# EAGLE design Raspberry_Pi_Lora_Shield (EAGLE 9.1.3)
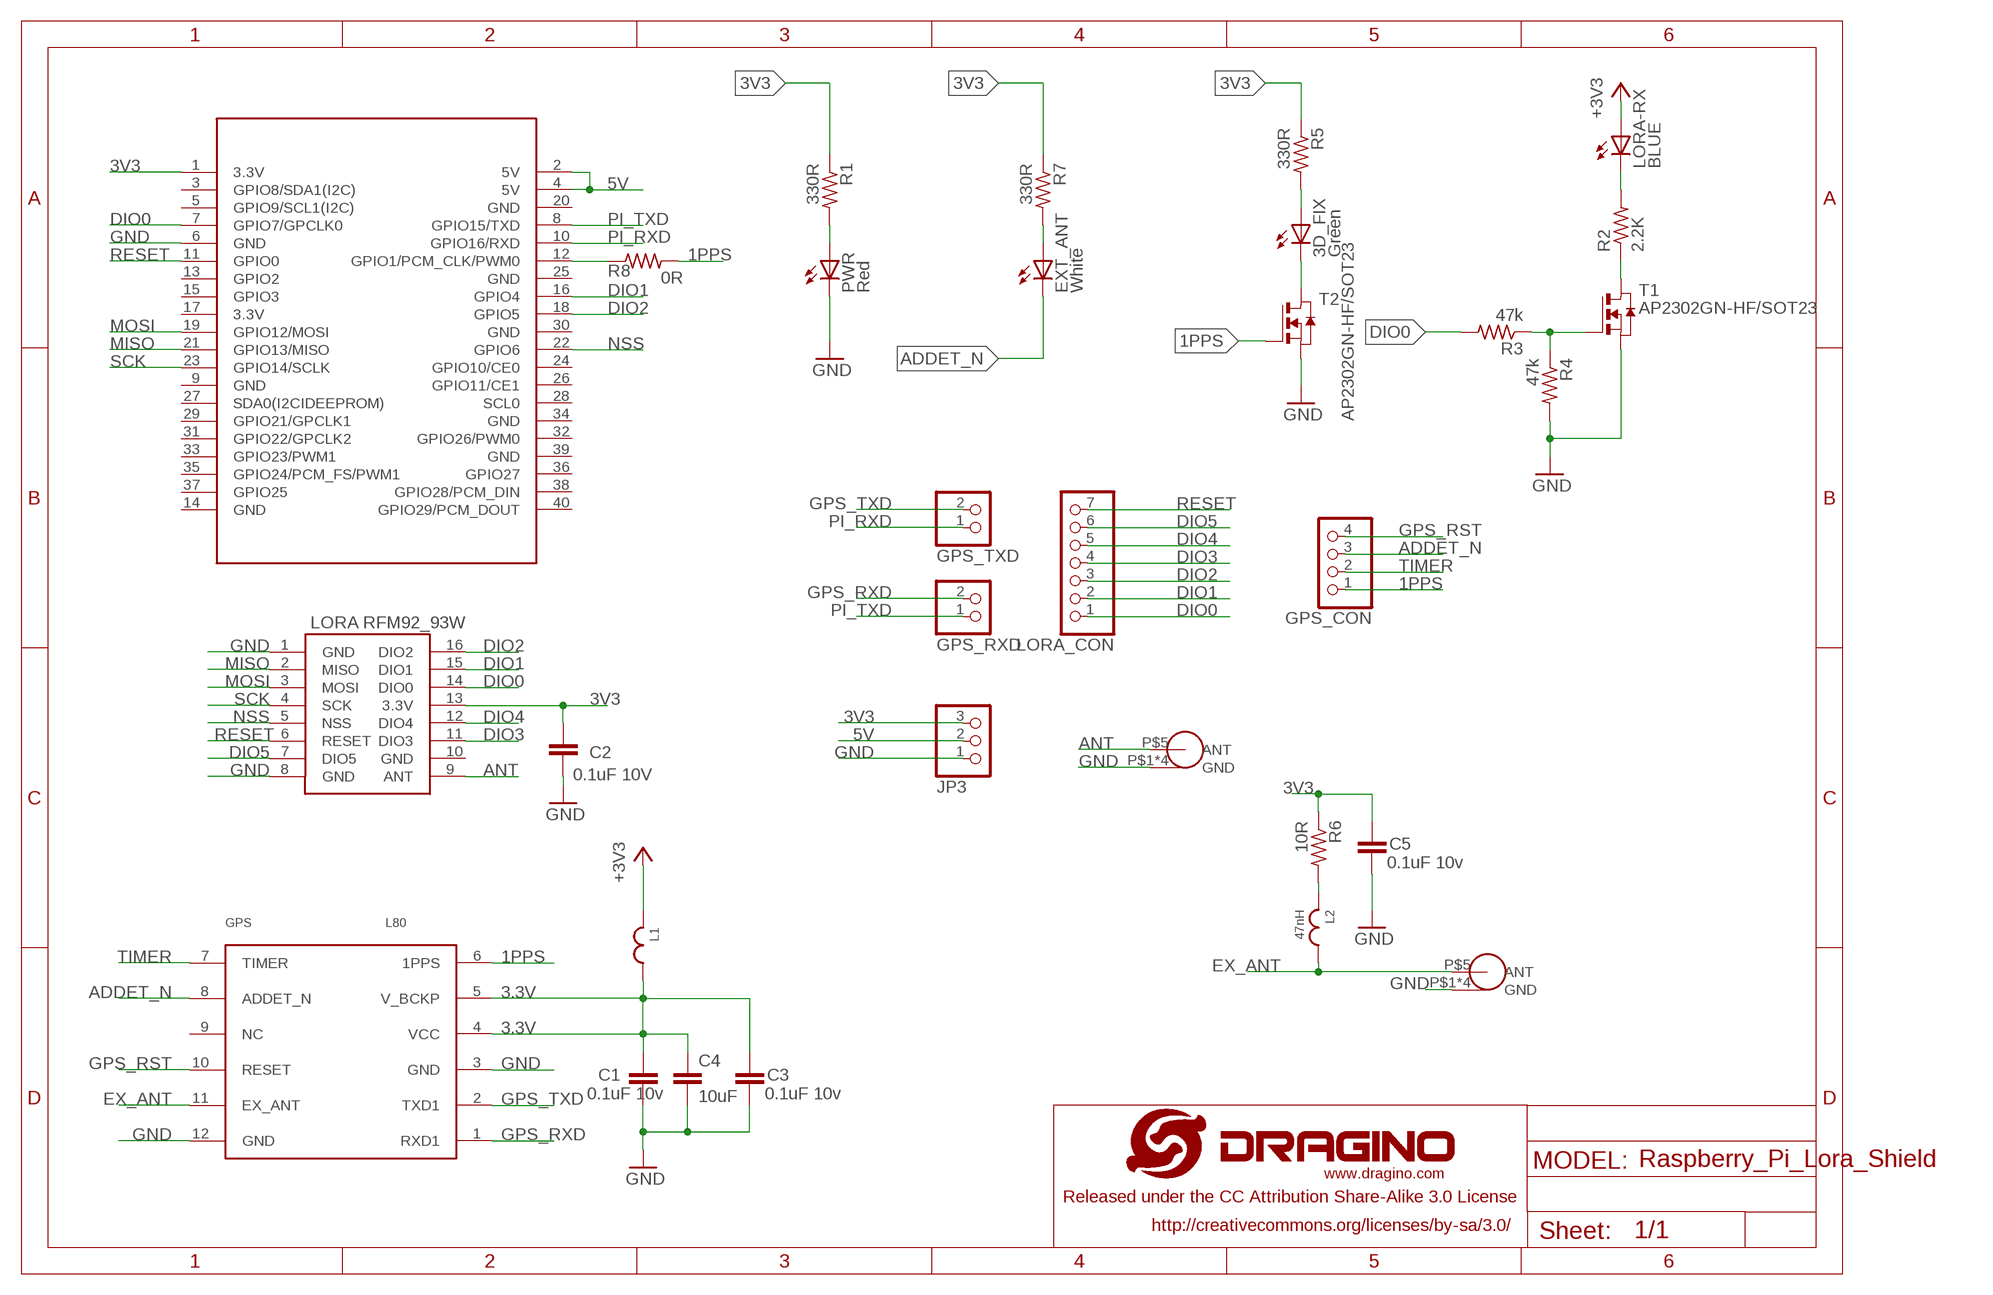
[diagram p0: schematic, sheet 1]

## Parts
3D_FIX  Green  LEDCHIPLED_0603  [CHIPLED_0603]
C1  0.1uF 10v  C-EUC0603  [C0603]
C2  0.1uF 10V  C-EUC0603  [C0603]
C3  0.1uF 10v  C-EUC0603  [C0603]
C4  10uF  C-EUC1206K  [C1206K]
C5  0.1uF 10v  C-EUC0603  [C0603]
EXT_ANT  White  LEDCHIPLED_0603  [CHIPLED_0603]
GPS  L80  [L80]
GPS_ANT  NL  SMA-KE  [SMA-KE]
GPS_CON  PINHD-1X4  [1X04]
GPS_RXD  PINHD-1X2  [1X02]
GPS_TXD  PINHD-1X2  [1X02]
JP3  PINHD-1X3  [1X03]
L1  JLC-PZ2012D800-3R0TF  BEADS0805  [C0805]
L2  47nH  INDUCTOR_0402  [C0402]
LORA  RFM92_93W  [RFM92_93W]
LORA-RX  BLUE  LEDCHIPLED_0603  [CHIPLED_0603]
LORA_ANT  SMA-KE  [SMA-KE]
LORA_CON  PINHD-1X7  [1X07]
PWR  Red  LEDCHIPLED_0603  [CHIPLED_0603]
R1  330R  R-US_R0603  [R0603]
R2  2.2K  R-US_R0603  [R0603]
R3  47k  R-US_R0603  [R0603]
R4  47k  R-US_R0603  [R0603]
R5  330R  R-US_R0603  [R0603]
R6  10R  R-US_R0603  [R0603]
R7  330R  R-US_R0603  [R0603]
R8  0R  R-US_R0805  [R0805]
T1  AP2302GN-HF/SOT23  NMOSFET-SOT23  [SOT-23]
T2  AP2302GN-HF/SOT23  NMOSFET-SOT23  [SOT-23]
U$1  LOGO-NEW  [LOGO-SILK-NEW]
U$2  RPILORASHIELD  [RPILORASHIELD]

## Nets
1PPS: GPS.6(1PPS) GPS_CON.1 R8.2 T2.3(G)
3.3V: C1.2 C3.2 C4.1 GPS.4(VCC) GPS.5(V_BCKP) L1.2
3V3: C2.2 C5.2 JP3.3 L1.1 LORA-RX.A LORA.13(3.3V) R1.1 R5.1 R6.1 R7.1 U$2.1(3.3V) ; supply symbol labelled +3V3
5V: JP3.2 U$2.2(5V) U$2.4(5V)
/RESET: R2.1 T1.1(D)
ADDET_N: EXT_ANT.C GPS.8(ADDET_N) GPS_CON.3
ANT: LORA.9(ANT) LORA_ANT.P$5(ANT)
DIO0: LORA.14(DIO0) LORA_CON.1 R3.2 U$2.7(GPIO7/GPCLK0)
DIO1: LORA.15(DIO1) LORA_CON.2 U$2.16(GPIO4)
DIO2: LORA.16(DIO2) LORA_CON.3 U$2.18(GPIO5)
DIO3: LORA.11(DIO3) LORA_CON.4
DIO4: LORA.12(DIO4) LORA_CON.5
DIO5: LORA.7(DIO5) LORA_CON.6
EX_ANT: GPS.11(EX_ANT) GPS_ANT.P$5(ANT) L2.2
GND: C1.1 C2.1 C3.1 C4.2 C5.1 GPS.3(GND) GPS.12(GND) GPS_ANT.P$1(GND) GPS_ANT.P$2(GND) GPS_ANT.P$3(GND) GPS_ANT.P$4(GND) JP3.1 LORA.1(GND) LORA.8(GND) LORA_ANT.P$1(GND) LORA_ANT.P$2(GND) LORA_ANT.P$3(GND) LORA_ANT.P$4(GND) PWR.C R4.2 T1.2(S) T2.2(S) U$2.6(GND)
GPS_RST: GPS.10(RESET) GPS_CON.4
GPS_RXD: GPS.1(RXD1) GPS_RXD.2
GPS_TXD: GPS.2(TXD1) GPS_TXD.2
MISO: LORA.2(MISO) U$2.21(GPIO13/MISO)
MOSI: LORA.3(MOSI) U$2.19(GPIO12/MOSI)
N$1: R3.1 R4.1 T1.3(G)
N$2: 3D_FIX.A R5.2
N$3: 3D_FIX.C T2.1(D)
N$4: L2.1 R6.2
N$5: EXT_ANT.A R7.2
N$6: PWR.A R1.2
N$7: R8.1 U$2.12(GPIO1/PCM_CLK/PWM0)
N$60: LORA-RX.C R2.2
NSS: LORA.5(NSS) U$2.22(GPIO6)
PI_RXD: GPS_TXD.1 U$2.10(GPIO16/RXD)
PI_TXD: GPS_RXD.1 U$2.8(GPIO15/TXD)
RESET: LORA.6(RESET) LORA_CON.7 U$2.11(GPIO0)
SCK: LORA.4(SCK) U$2.23(GPIO14/SCLK)
TIMER: GPS.7(TIMER) GPS_CON.2
Unconnected: GPS.9(NC) U$2.3(GPIO8/SDA1(I2C)) U$2.5(GPIO9/SCL1(I2C)) U$2.9(GND) U$2.13(GPIO2) U$2.14(GND) U$2.15(GPIO3) U$2.17(3.3V) U$2.20(GND) U$2.24(GPIO10/CE0) U$2.25(GND) U$2.26(GPIO11/CE1) U$2.27(SDA0(I2CIDEEPROM)) U$2.28(SCL0) U$2.29(GPIO21/GPCLK1) U$2.30(GND) U$2.31(GPIO22/GPCLK2) U$2.32(GPIO26/PWM0) U$2.33(GPIO23/PWM1) U$2.34(GND) U$2.35(GPIO24/PCM_FS/PWM1) U$2.36(GPIO27) U$2.37(GPIO25) U$2.38(GPIO28/PCM_DIN) U$2.39(GND) U$2.40(GPIO29/PCM_DOUT)

## Power pins joined to a net without a drawn wire
GND: LORA.10(GND)

## Library data of the parts
3D_FIX EXT_ANT PWR = dragino:LED: LED OSRAM: - CHIPLED LG R971, LG N971, LY N971, LG Q971, LY Q971, LO R971, LY R971 LH N974, LH R974 LS Q976, LO Q976, LY Q976 LO Q996 - Hyper CHIPLED LW Q18S LB Q993, LB Q99A, LB R99A - SideLED LS A670, LO A670, LY A670, LG A670, LP A670 LB A673, LV A673, LT A673, LW A673 LH A674 LY A675 LS A676, LA A676, LO A676, LY A676, LW A676 LS A679, LY A679, LG A679 - Hyper Micro SIDELED® LS Y876, LA Y876, LO Y876, LY Y876 LT Y87S - SmartLED LW L88C, LW L88S LB L89C, LB L89S, LG L890 LS L89K, LO L89K, LY L89K LS L896, LA L896, LO L896, LY L896 - TOPLED LS T670, LO T670, LY T670, LG T670, LP T670 LSG T670, LSP T670, LSY T670, LOP T670, LYG T670 LG T671, LOG T671, LSG T671 LB T673, LV T673, LT T673, LW T673 LH T674 LS T676, LA T676, LO T676, LY T676, LB T676, LH T676, LSB T676, LW T676 LB T67C, LV T67C, LT T67C, LS T67K, LO T67K, LY T67K, LW E67C LS E67B, LA E67B, LO E67B, LY E67B, LB E67C, LV E67C, LT E67C LW T67C LS T679, LY T679, LG T679 LS T770, LO T770, LY T770, LG T770, LP T770 LB T773, LV T773, LT T773, LW T773 LH T774 LS E675, LA E675, LY E675, LS T675 LS T776, LA T776, LO T776, LY T776, LB T776 LHGB T686 LT T68C, LB T68C - Hyper Mini TOPLED® LB M676 - Mini TOPLED Santana® LG M470 LS M47K, LO M47K, LY M47K Source: http://www.osram.convergy.de LUXEON: - LUMILED® LXK2-PW12-R00, LXK2-PW12-S00, LXK2-PW14-U00, LXK2-PW14-V00 LXK2-PM12-R00, LXK2-PM12-S00, LXK2-PM14-U00 LXK2-PE12-Q00, LXK2-PE12-R00, LXK2-PE12-S00, LXK2-PE14-T00, LXK2-PE14-U00 LXK2-PB12-K00, LXK2-PB12-L00, LXK2-PB12-M00, LXK2-PB14-N00, LXK2-PB14-P00, LXK2-PB14-Q00 LXK2-PR12-L00, LXK2-PR12-M00, LXK2-PR14-Q00, LXK2-PR14-R00 LXK2-PD12-Q00, LXK2-PD12-R00, LXK2-PD12-S00 LXK2-PH12-R00, LXK2-PH12-S00 LXK2-PL12-P00, LXK2-PL12-Q00, LXK2-PL12-R00 Source: www.luxeon.com KINGBRIGHT: KA-3528ASYC Source: www.kingbright.com
C1-C5 = dragino-passive:C-EU: CAPACITOR, European symbol
GPS = L80:L80
GPS_ANT LORA_ANT = sma-ke:SMA-KE
GPS_CON = pinhead:PINHD-1X4: PIN HEADER
GPS_RXD GPS_TXD = pinhead:PINHD-1X2: PIN HEADER
JP3 = pinhead:PINHD-1X3: PIN HEADER
L1 = dragino:BEADS
L2 = dragino-passive:INDUCTOR_: INDUCTOR, European symbol
LORA = dragino:RFM92_93W
LORA-RX = dragino-passive:LED: LED OSRAM: - CHIPLED LG R971, LG N971, LY N971, LG Q971, LY Q971, LO R971, LY R971 LH N974, LH R974 LS Q976, LO Q976, LY Q976 LO Q996 - Hyper CHIPLED LW Q18S LB Q993, LB Q99A, LB R99A - SideLED LS A670, LO A670, LY A670, LG A670, LP A670 LB A673, LV A673, LT A673, LW A673 LH A674 LY A675 LS A676, LA A676, LO A676, LY A676, LW A676 LS A679, LY A679, LG A679 - Hyper Micro SIDELED® LS Y876, LA Y876, LO Y876, LY Y876 LT Y87S - SmartLED LW L88C, LW L88S LB L89C, LB L89S, LG L890 LS L89K, LO L89K, LY L89K LS L896, LA L896, LO L896, LY L896 - TOPLED LS T670, LO T670, LY T670, LG T670, LP T670 LSG T670, LSP T670, LSY T670, LOP T670, LYG T670 LG T671, LOG T671, LSG T671 LB T673, LV T673, LT T673, LW T673 LH T674 LS T676, LA T676, LO T676, LY T676, LB T676, LH T676, LSB T676, LW T676 LB T67C, LV T67C, LT T67C, LS T67K, LO T67K, LY T67K, LW E67C LS E67B, LA E67B, LO E67B, LY E67B, LB E67C, LV E67C, LT E67C LW T67C LS T679, LY T679, LG T679 LS T770, LO T770, LY T770, LG T770, LP T770 LB T773, LV T773, LT T773, LW T773 LH T774 LS E675, LA E675, LY E675, LS T675 LS T776, LA T776, LO T776, LY T776, LB T776 LHGB T686 LT T68C, LB T68C - Hyper Mini TOPLED® LB M676 - Mini TOPLED Santana® LG M470 LS M47K, LO M47K, LY M47K Source: http://www.osram.convergy.de LUXEON: - LUMILED® LXK2-PW12-R00, LXK2-PW12-S00, LXK2-PW14-U00, LXK2-PW14-V00 LXK2-PM12-R00, LXK2-PM12-S00, LXK2-PM14-U00 LXK2-PE12-Q00, LXK2-PE12-R00, LXK2-PE12-S00, LXK2-PE14-T00, LXK2-PE14-U00 LXK2-PB12-K00, LXK2-PB12-L00, LXK2-PB12-M00, LXK2-PB14-N00, LXK2-PB14-P00, LXK2-PB14-Q00 LXK2-PR12-L00, LXK2-PR12-M00, LXK2-PR14-Q00, LXK2-PR14-R00 LXK2-PD12-Q00, LXK2-PD12-R00, LXK2-PD12-S00 LXK2-PH12-R00, LXK2-PH12-S00 LXK2-PL12-P00, LXK2-PL12-Q00, LXK2-PL12-R00 Source: www.luxeon.com KINGBRIGHT: KA-3528ASYC Source: www.kingbright.com
LORA_CON = pinhead:PINHD-1X7: PIN HEADER
R1-R8 = dragino:R-US_: RESISTOR, American symbol
T1 T2 = dragino:NMOSFET-SOT23: MOS FET; OC_FARNELL: unknown; OC_NEWARK: unknown
U$1 = dragino:LOGO-NEW
U$2 = lorarpi:RPILORASHIELD

## Net classes
2 gnd: width 0.254 mm, drill 0.61 mm, clearance 0.254 mm

## Board
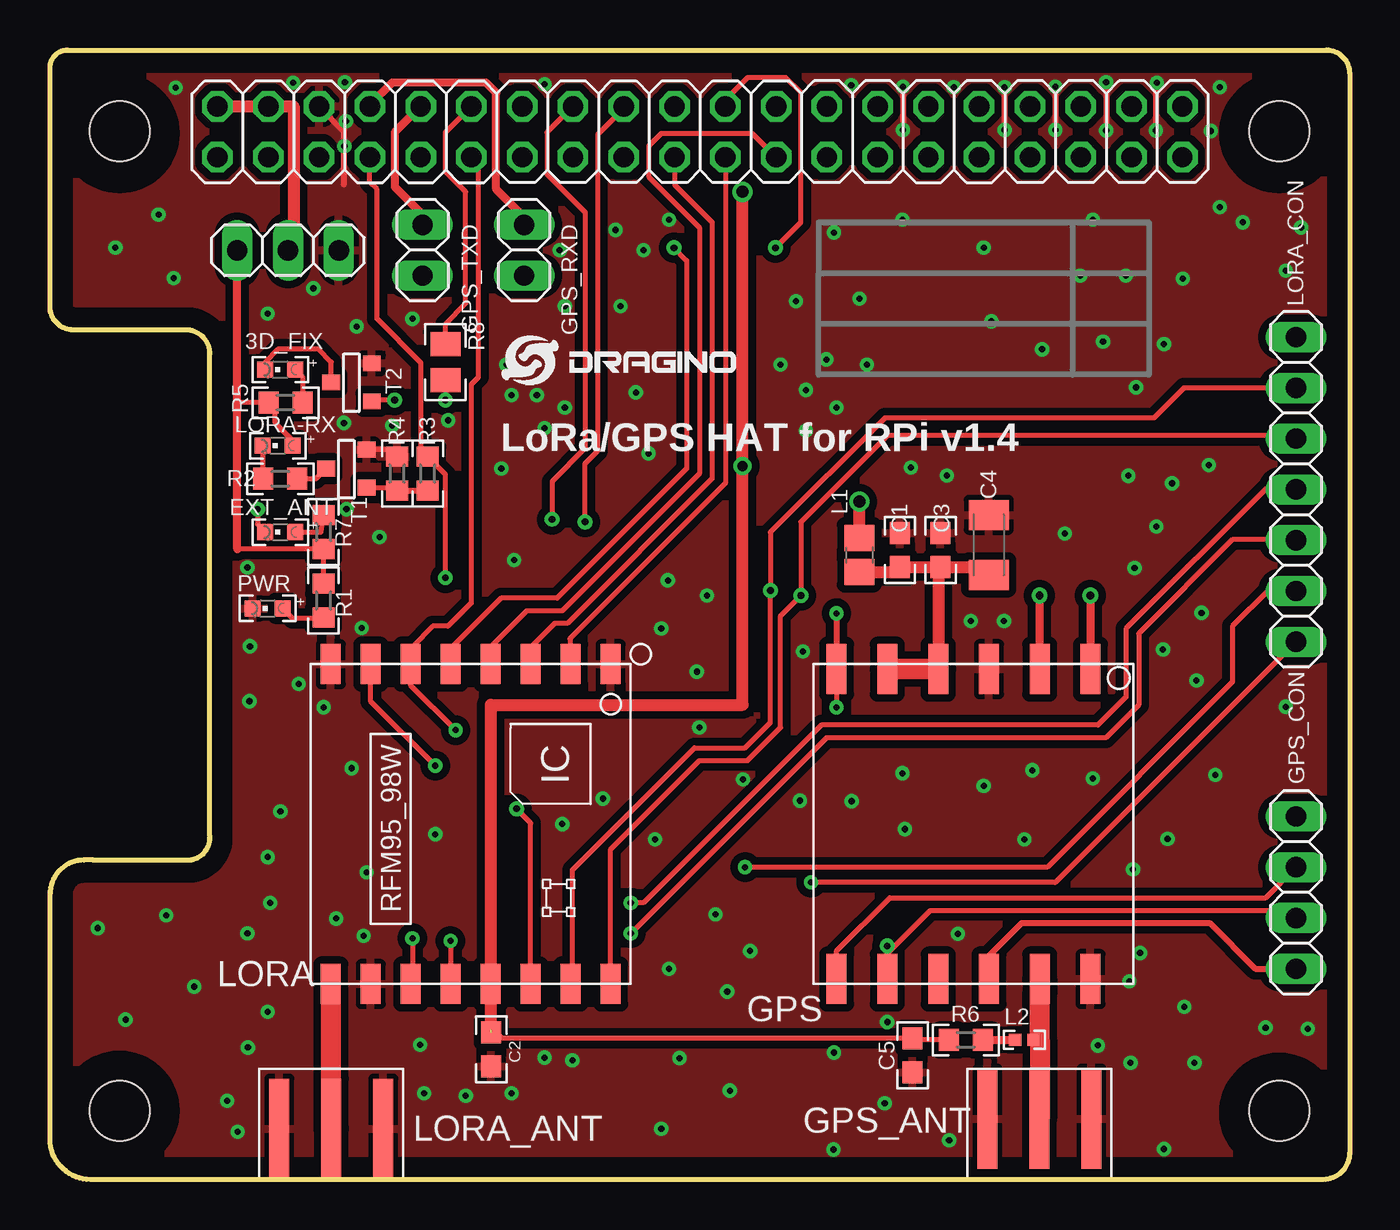
[diagram p1: board, top side]
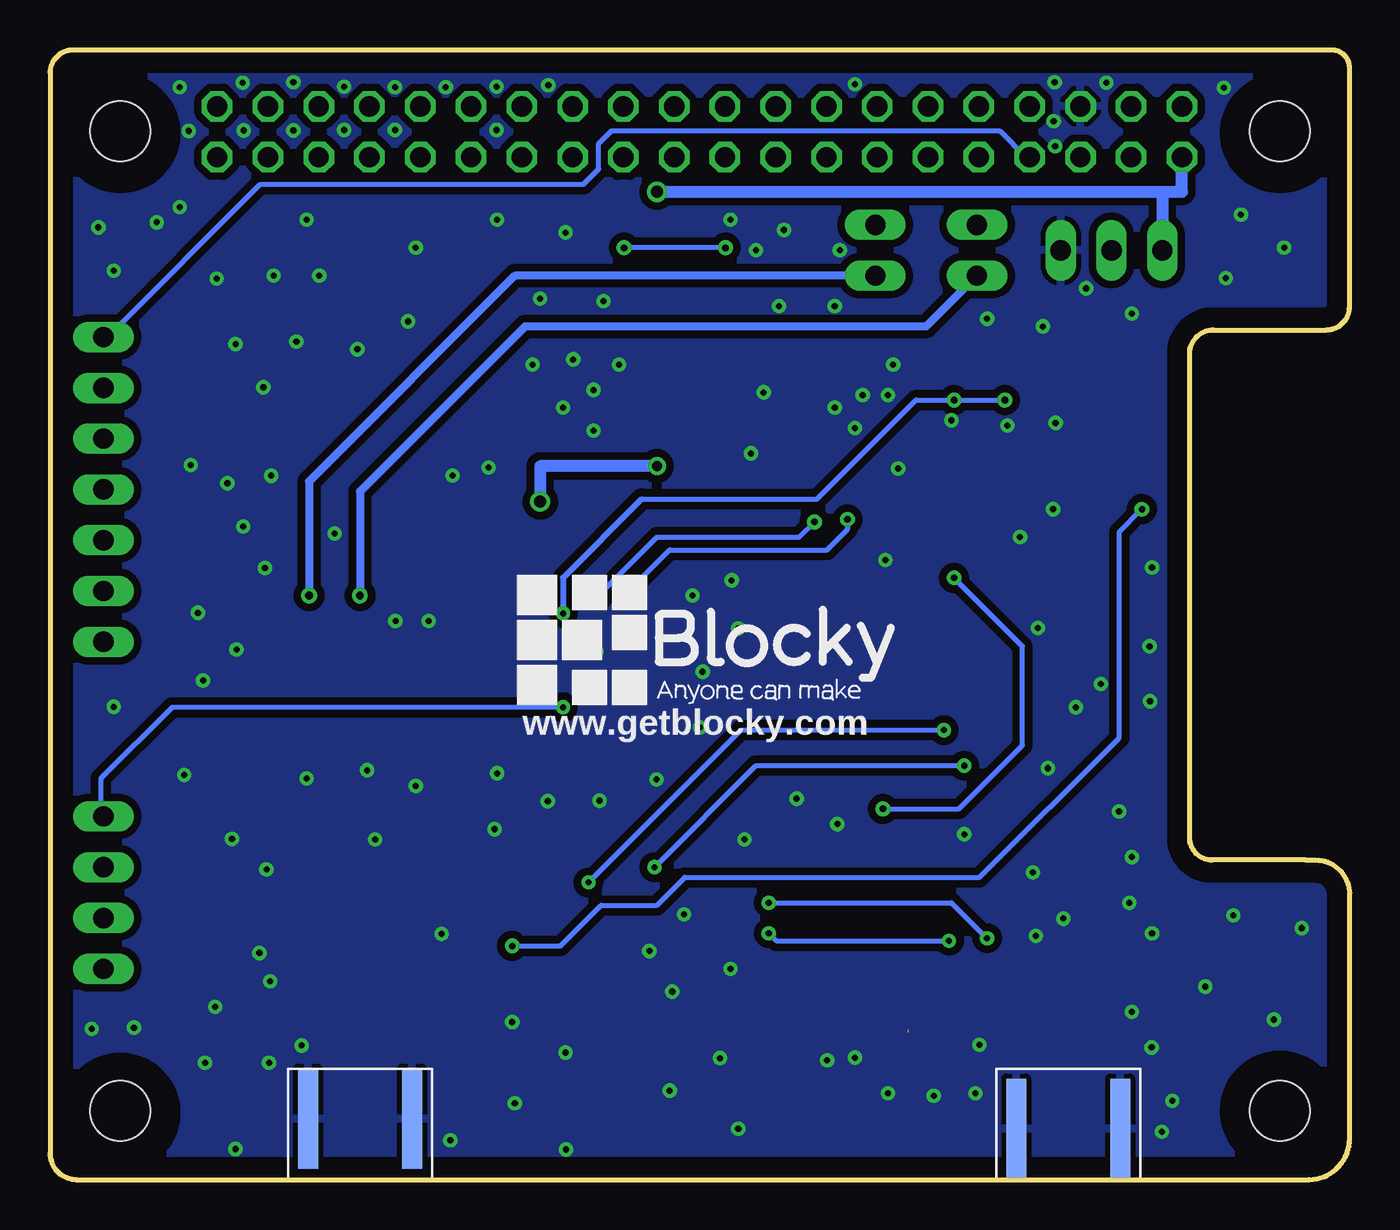
[diagram p2: board, bottom side, seen from below]

Size 65 x 56.5 mm. Coordinates in mm from the lower left corner, seen from the top.
Copper layers (1*16): Top 0.035mm / dielectric 1.5mm / Bottom 0.035mm
Design rules "default *": minimum track width 10mil, minimum drill 12mil, track to track 6mil, track to pad 6mil, pad to pad 6mil, via to via 6mil, smd to smd 6mil, copper to edge 40mil, drill to drill 8mil, minimum pad ring 10mil, minimum via ring 8mil, stop-mask expansion 4mil, vias tented up to drill 30mil, thermal gap 10mil

### Footprints (pad centres in the part's own frame; a part is rotated, then mirrored left to right if it is on the bottom)
CHIPLED_0603 = smd 0.8 x 0.8: A 0,-0.75; C 0,0.75
C0603 = smd 1.1 x 1: 1 -0.85,0; 2 0.85,0
C1206K = smd 1.5 x 2: 1 -1.5,0; 2 1.5,0
L80 = smd 2.5 x 1: 1 -7.75,5.85; 2 -7.75,3.31; 3 -7.75,0.77; 4 -7.75,-1.77; 5 -7.75,-4.31; 6 -7.75,-6.85; 7 7.75,-6.85; 8 7.75,-4.31; 9 7.75,-1.77; 10 7.75,0.77; 11 7.75,3.31; 12 7.75,5.85
SMA-KE = smd 1 x 5: P$1 -2.6,0; P$2 2.6,0; P$5 0,0 | smd 1 x 5 bottom: P$3 -2.6,0; P$4 2.6,0
1X04 = drill 1.016 long: 1 -3.81,0; 2 -1.27,0; 3 1.27,0; 4 3.81,0
1X02 = drill 1.016 long: 1 -1.27,0; 2 1.27,0
1X03 = drill 1.016 long: 1 -2.54,0; 2 0,0; 3 2.54,0
C0805 = smd 1.3 x 1.5: 1 -0.85,0; 2 0.85,0
C0402 = smd 0.61 x 0.61: 1 -0.457,0; 2 0.457,0
RFM92_93W = smd 2 x 1: 1 -8,7; 2 -8,5; 3 -8,3; 4 -8,1; 5 -8,-1; 6 -8,-3; 7 -8,-5; 8 -8,-7; 9 8,-7; 10 8,-5; 11 8,-3; 12 8,-1; 13 8,1; 14 8,3; 15 8,5; 16 8,7
1X07 = drill 1.016 long: 1 -7.62,0; 2 -5.08,0; 3 -2.54,0; 4 0,0; 5 2.54,0; 6 5.08,0; 7 7.62,0
R0603 = smd 1 x 1.1: 1 -0.85,0; 2 0.85,0
R0805 = smd 1.2 x 1.5: 1 -0.9,0; 2 0.9,0
SOT-23 = smd 0.787 x 0.889: 1 0,-1.016; 2 -0.95,1.016; 3 0.95,1.016
RPILORASHIELD = drill 1.016 octagon: 1 -24.1,23.2; 2 -24.1,25.74; 3 -21.56,23.2; 4 -21.56,25.74; 5 -19.02,23.2; 6 -19.02,25.74; 7 -16.48,23.2; 8 -16.48,25.74; 9 -13.94,23.2; 10 -13.94,25.74; 11 -11.4,23.2; 12 -11.4,25.74; 13 -8.86,23.2; 14 -8.86,25.74; 15 -6.32,23.2; 16 -6.32,25.74; 17 -3.78,23.2; 18 -3.78,25.74; 19 -1.24,23.2; 20 -1.24,25.74; 21 1.3,23.2; 22 1.3,25.74; 23 3.84,23.2; 24 3.84,25.74; 25 6.38,23.2; 26 6.38,25.74; 27 8.92,23.2; 28 8.92,25.74; 29 11.46,23.2; 30 11.46,25.74; 31 14,23.2; 32 14,25.74; 33 16.54,23.2; 34 16.54,25.74; 35 19.08,23.2; 36 19.08,25.74; 37 21.62,23.2; 38 21.62,25.74; 39 24.16,23.2; 40 24.16,25.74 | hole 3: -29,24.5; -29,-24.5; 29,24.5; 29,-24.5

### Placement (x,y rotation side)
3D_FIX  11.52,40.51 90 top
C1  42.51,31.5 270 top
C2  22.07,6.52 90 top
C3  44.54,31.5 270 top
C4  46.96,31.75 90 top
C5  43.15,6.22 90 top
EXT_ANT  11.52,32.38 90 top
GPS  46.2,17.78 270 top
GPS_ANT  49.5,3.05 180 top
GPS_CON  62.32,14.35 270 top
GPS_RXD  23.72,46.48 270 top
GPS_TXD  18.64,46.48 270 top
JP3  11.91,46.48 180 top
L1  40.48,31.24 270 top
L2  48.74,6.99 0 top
LORA  21.05,17.78 270 top
LORA-RX  11.4,36.7 90 top
LORA_ANT  14.06,2.54 0 top
LORA_CON  62.32,34.52 270 top
PWR  10.89,28.57 90 top
R1  13.68,28.96 270 top
R2  11.52,35.05 180 top
R3  18.89,35.31 90 top
R4  17.37,35.31 90 top
R5  11.78,38.86 0 top
R6  45.81,6.99 0 top
R7  13.68,32.38 90 top
R8  19.78,40.89 270 top
T1  14.83,35.56 270 top
T2  15.08,39.88 270 top
U$1  22.6,39.75 0 top
U$2  32.48,27.94 0 top
U$3  [BLOCKY_LOGO]  42.64,23.5 0 bottom

### Tracks (layer width: path | path; a pad name or v marks a point on that pad's centre or on a via)
1PPS  (via drill 0.3, 0.33)
  Top 0.254: GPS.6 v39.35,23.63 v39.34,23.62 | v17.24,38.99 16.16,38.99 T2.3 | R8.2 v19.78,38.99
  Top 0.305: v39.34,28.32 39.34,25.54 GPS.6
  Bottom 0.254: v39.34,23.62 58.9,23.62 62.45,20.07 62.45,18.29 GPS_CON.1 | 35.4,34.04 26.64,34.04 21.68,38.99 v19.78,38.99 v17.24,38.99
  Bottom 0.305: 35.4,34.04 39.34,30.1 v39.34,28.32
3.3V
  Top 0.61: L1.2 42.51,30.39 C1.2 C3.2 | C3.2 44.43,30.77 GPS.4 | C4.1 46.54,30.67 46.32,30.67 46.21,30.65 C3.2
  Top 1.016: GPS.4 GPS.5
3V3  (via drill 0.51, 0.6)  (1 unrouted)
  Top 0.254: 9.37,38.86 R5.1 11.27,38.81 11.27,37.85 12.15,36.97 LORA-RX.A | R1.1 R7.1 9.37,31.54 | C2.2 22.07,7.62 22.61,7.07 C5.2 43.13,7 43.1,6.99 R6.1
  Top 0.406: 22.07,7.49 22.05,7.49 | 9.37,31.54 9.37,38.86 JP3.3
  Top 0.61: v34.64,49.4 v34.64,35.69 34.64,23.75 22.05,23.75 LORA.13 22.07,9.76 C2.2 | L1.1 v40.48,33.91
  Bottom 0.61: v34.64,49.4 9.37,49.4 | 9.37,49.4 JP3.3 | 9.37,49.4 8.38,49.4 U$2.1 | v34.64,35.69 40.48,35.69 v40.48,33.91
5V
  Top 0.61: U$2.2 U$2.4 12.18,53.68 12.18,46.48 JP3.2
/RESET
  Top 0.254: R2.1 13.3,35.05 T1.1
ADDET_N  (via drill 0.33)
  Top 0.254: GPS_CON.3 61.94,13.46 44.04,13.46 41.89,11.31 GPS.8 v41.89,11.68 v41.88,11.68 | v10.38,33.53 10.38,32.78 EXT_ANT.C
  Bottom 0.254: v41.88,11.68 39.46,11.68 37.43,13.72 34.64,13.72 33.24,15.11 18.51,15.11 11.52,22.1 11.52,32.38 v10.38,33.53
ANT
  Top 1: LORA.9 14.05,2.56 LORA_ANT.P$5
DIO0  (via drill 0.33)
  Top 0.254: LORA.14 24.05,17.83 v23.34,18.54 | U$2.7 16,49.88 16.35,49.53 16.35,43.05 18.56,40.84 18.56,36.69 18.6,36.45 R3.2 19.78,35.27 v19.78,30.1
  Bottom 0.254: U$2.7 16.18,51.14 17.49,52.45 36.92,52.45 37.56,51.82 37.56,50.55 38.32,49.78 54.48,49.78 62.12,42.14 LORA_CON.1 | v23.34,18.54 19.53,18.54 16.35,21.72 16.35,26.67 v19.78,30.1
DIO1  (via drill 0.33)
  Top 0.254: U$2.16 24.86,52.38 24.86,50.29 26.76,48.39 26.76,36.58 25.11,34.92 v25.11,33.02 | LORA.15 26.13,9.78 26.13,15.49 32.23,21.59 34.77,21.59 36.04,22.86 v36.04,29.46 36.04,32.38 41.75,38.1 55.21,38.1 56.71,39.6 LORA_CON.2
  Bottom 0.254: v36.04,29.46 34,31.5 26.13,31.5 25.11,32.51 v25.11,33.02
DIO2  (via drill 0.33)
  Top 0.254: LORA.16 28.05,16.52 32.48,20.95 34.89,20.95 36.54,22.61 36.54,28.19 v37.56,29.21 37.56,32.89 41.88,37.21 62.17,37.21 LORA_CON.3 | v26.76,32.89 26.76,35.81 27.4,36.45 27.4,52.25 28.7,53.55 U$2.18
  Bottom 0.254: v37.56,29.21 34.64,32.13 27.53,32.13 v26.76,32.89
DIO3  (via drill 0.3)
  Top 0.254: LORA_CON.4 60.83,34.52 60.8,34.54 53.82,27.56 53.82,24.13 52.42,22.73 38.58,22.73 29.69,13.84 v29.05,13.84 | v18.13,12.06 18.13,9.27 18.26,9.14 18.26,9.57 LORA.11
  Bottom 0.254: v29.05,13.84 19.91,13.84 v18.13,12.06
DIO4  (via drill 0.3)
  Top 0.254: LORA_CON.5 62.3,32 59.15,32 54.45,27.3 54.45,23.75 52.8,22.1 38.83,22.1 v29.05,12.32 | v20.03,11.94 20.05,11.92 LORA.12
  Bottom 0.254: v29.05,12.32 28.67,11.94 v20.03,11.94
DIO5  (via drill 0.3)
  Top 0.254: LORA_CON.6 62.3,29.46 60.93,29.46 59.15,27.69 59.15,24.89 49.88,15.62 v34.77,15.62 | v19.27,20.7 16.05,23.92 LORA.7
  Bottom 0.254: v34.77,15.62 29.69,20.7 v19.27,20.7
EX_ANT
  Top 0.254: L2.2 49.51,6.99
  Top 0.762: GPS_ANT.P$5
  Top 1: GPS.11 49.51,9.27 49.51,6.99 GPS_ANT.P$5
GND  (via drill 0.3)
  Top 0.254: T1.2 16.99,36.51 17.21,36.29 17.31,36.16 R4.2
  Top 0.305: v14.8,52.93 14.7,52.83 14.7,50.29 | U$2.6 14.7,52.44 14.7,49.78 | v42.66,54.66 v42.66,52.5 | v47.74,54.63 v47.74,52.5 | v50.28,54.66 v50.28,52.5 | v52.82,54.89 v52.82,52.48 | v55.36,54.86 55.31,54.81 v55.31,52.48
  other vias: 3.27,46.61 14.73,51.69 12.16,54.86 5.43,48.26 6.19,45.09 10.89,43.31 13.18,44.58 15.33,42.67 18.13,43.05 28.29,47.5 25.49,46.48 22.83,40.77 25.75,43.69 28.54,43.69 29.69,46.48 30.96,48.01 19.91,37.97 23.08,39.24 9.87,30.61 10,26.67 11.52,18.41 10.89,16.13 13.68,23.62 5.81,13.21 9.87,12.32 7.21,9.65 3.78,8 8.86,3.94 18.51,6.73 10.89,8.38 15.84,15.37 15.08,20.57 57.24,5.84 56.74,8.64 55.72,1.52 41.88,7.87 39.21,6.35 41.75,3.81 34,4.45 33.88,9.4 35.02,11.43 26.13,5.97 30.57,2.54 23.08,4.32 24.73,6.1 20.8,4.19 42.77,17.53 46.7,19.68 40.1,18.92 42.64,20.32 52.16,20.07 48.74,17.02 30.96,10.54 25.62,17.78 27.65,19.05 19.27,17.27 32.35,25.4 30.57,27.56 32.86,29.21 23.21,30.99 24.73,37.59 25.75,38.61 29.3,39.37 22.57,35.56 24.35,39.24 29.94,36.32 47.72,27.94 46.07,27.94 46.7,46.61 39.21,47.37 42.64,48.01 52.16,48.01 51.53,45.21 49.62,41.53 47.08,42.93 52.67,41.91 53.82,45.21 55.72,41.78 54.32,39.62 40.48,44.07 37.31,43.94 36.54,40.77 38.83,41.02 40.86,40.77 37.81,39.5 37.81,37.47 59.66,47.88 58.51,48.64 62.58,47.62 61.82,45.47 32.48,22.61 9.98,23.93 50.77,32.31 53.94,35.2 57.96,35.74 55.34,32.66 54.25,30.58 56.13,34.82 57.6,28.35 55.67,26.52 57.35,24.97 49.14,20.47 31.49,6.07 39.19,1.5 44.98,1.96 54.04,5.84 52.42,6.71 60.8,7.59 62.91,7.54 45.41,12.29 54.53,11.33 55.9,17.04 54.17,15.52 58.29,20.24 61.82,23.65 53.99,9.91 14.32,13.06 15.69,12.19 9.9,6.6 9.39,2.39 18.71,4.32 14.75,54.89 6.29,54.61 24.73,54.79 45.21,54.64 40.07,54.74 56.66,45.06 58.51,54.64 58.06,52.45 33.29,13.26 37.51,18.95 30.91,29.97 15.59,27.58 12.44,24.79 14.7,37.85 17.11,37.72 16.48,32.13 14.83,33.53 39.34,38.61 11.02,13.84 2.38,12.57 37.66,26.41 34.66,20.01 30.26,17.01 43.06,35.61 44.86,35.21
  pour Bottom (isolate 0.381): 0.09,56.01 0.09,42.42 8.1,42.42 8.1,16 0.09,16 0.09,0 64.99,0 64.99,56.52 0.09,56.52 0.09,56.13
  pour Top (isolate 0.381): 0.22,56.52 64.99,56.52 64.99,0 0.09,0 0.09,16 8.1,16 8.1,42.42 -0.03,42.42 -0.03,56.52
GPS_RST
  Top 0.305: GPS.10 46.97,11.18 48.61,12.83 58.01,12.83 60.29,10.54 GPS_CON.4
GPS_RXD  (via drill 0.38)
  Top 0.406: v52.04,29.21 52.04,25.53 GPS.1
  Bottom 0.406: GPS_RXD.2 41.75,45.21 52.04,34.92 v52.04,29.21
GPS_TXD  (via drill 0.38)
  Top 0.406: v49.5,29.21 49.5,25.53 GPS.2
  Bottom 0.406: GPS_TXD.2 21.18,42.67 | 21.18,42.67 41.24,42.67 | 41.24,42.67 49.5,34.42 v49.5,29.21 | 21.18,42.67 41.24,42.67
MISO
  Top 0.254: U$2.21 33.78,34.83 26,27.05 26,25.83 LORA.2
MOSI
  Top 0.254: U$2.19 31.24,49.75 33.11,47.88 33.11,35.05 25.88,27.81 25.24,27.81 24.1,26.67 24.1,25.83 LORA.3
N$1
  Top 0.254: T1.3 17.13,34.61 R4.1
  Top 0.305: R4.1 R3.1
N$2
  Top 0.254: 3D_FIX.A 12.63,40.16 R5.2
N$3
  Top 0.254: T2.1 14.06,40.89 13.43,41.53 11.4,41.53 10.76,40.89 10.76,40.52 3D_FIX.C
N$4
  Top 0.406: R6.2 L2.1
N$5
  Top 0.254: EXT_ANT.A 13.56,32.38 R7.2
N$6
  Top 0.254: R1.2 13.72,28.07 12.15,28.07 PWR.A
N$7
  Top 0.254: R8.1 19.78,42.8 20.8,43.81 20.8,49.4 19.78,50.42 19.78,52.38 U$2.12
N$60
  Top 0.254: LORA-RX.C 10.77,36.58 10.67,36.38 R2.2
NSS  (via drill 0.33)
  Top 0.254: LORA.5 20.05,26.56 22.57,29.08 25.37,29.08 31.84,35.56 31.84,45.97 v31.21,46.61 | v36.29,46.61 37.56,47.88 37.56,54.36 36.8,55.12 34.89,55.12 33.78,54.01 U$2.22
  Bottom 0.254: v31.21,46.61 v36.29,46.61
PI_RXD
  Top 0.406: U$2.10 17.24,52.38 17.24,49.66 18.64,48.26 GPS_TXD.1
PI_TXD
  Top 0.406: GPS_RXD.1 23.72,48.13 22.32,49.53 22.32,54.36 21.81,54.86 17.11,54.86 16,53.75 U$2.8
RESET  (via drill 0.3)
  Top 0.254: LORA_CON.7 50.28,14.86 v38.07,14.86 | v20.29,22.48 18.05,24.72 LORA.6 18.13,25.86 18.13,26.67 19.14,27.69 19.91,27.69 21.08,28.86 21.08,39.78 21.43,40.13 21.43,50.79 U$2.11
  Bottom 0.254: v38.07,14.86 30.45,22.48 v20.29,22.48
SCK
  Top 0.254: U$2.23 35.14,52.32 30.57,52.32 29.94,51.69 29.94,50.16 32.48,47.62 32.48,35.31 25.62,28.45 23.84,28.45 22.07,26.67 22.07,25.8 LORA.4
TIMER
  Top 0.254: GPS.7 39.35,11.44 42,14.1 60.8,14.1 GPS_CON.2

### Text on the board
tPlace: LoRa/GPS HAT for RPi v1.4 | LORA
tDocu: 433MHZ | 3.3V | 5V | GND | 868MHZ | DIO0 | 915MHZ | DIO1 | DIO2 | DIO3 | DIO4 | DIO5 | RESET | PPS | TIMER | ADDET_N | RST